# Altium project rt10-r2.PrjPcb (part 2 of 2)

## Sheet mimxrt10xx.SchDoc
size C
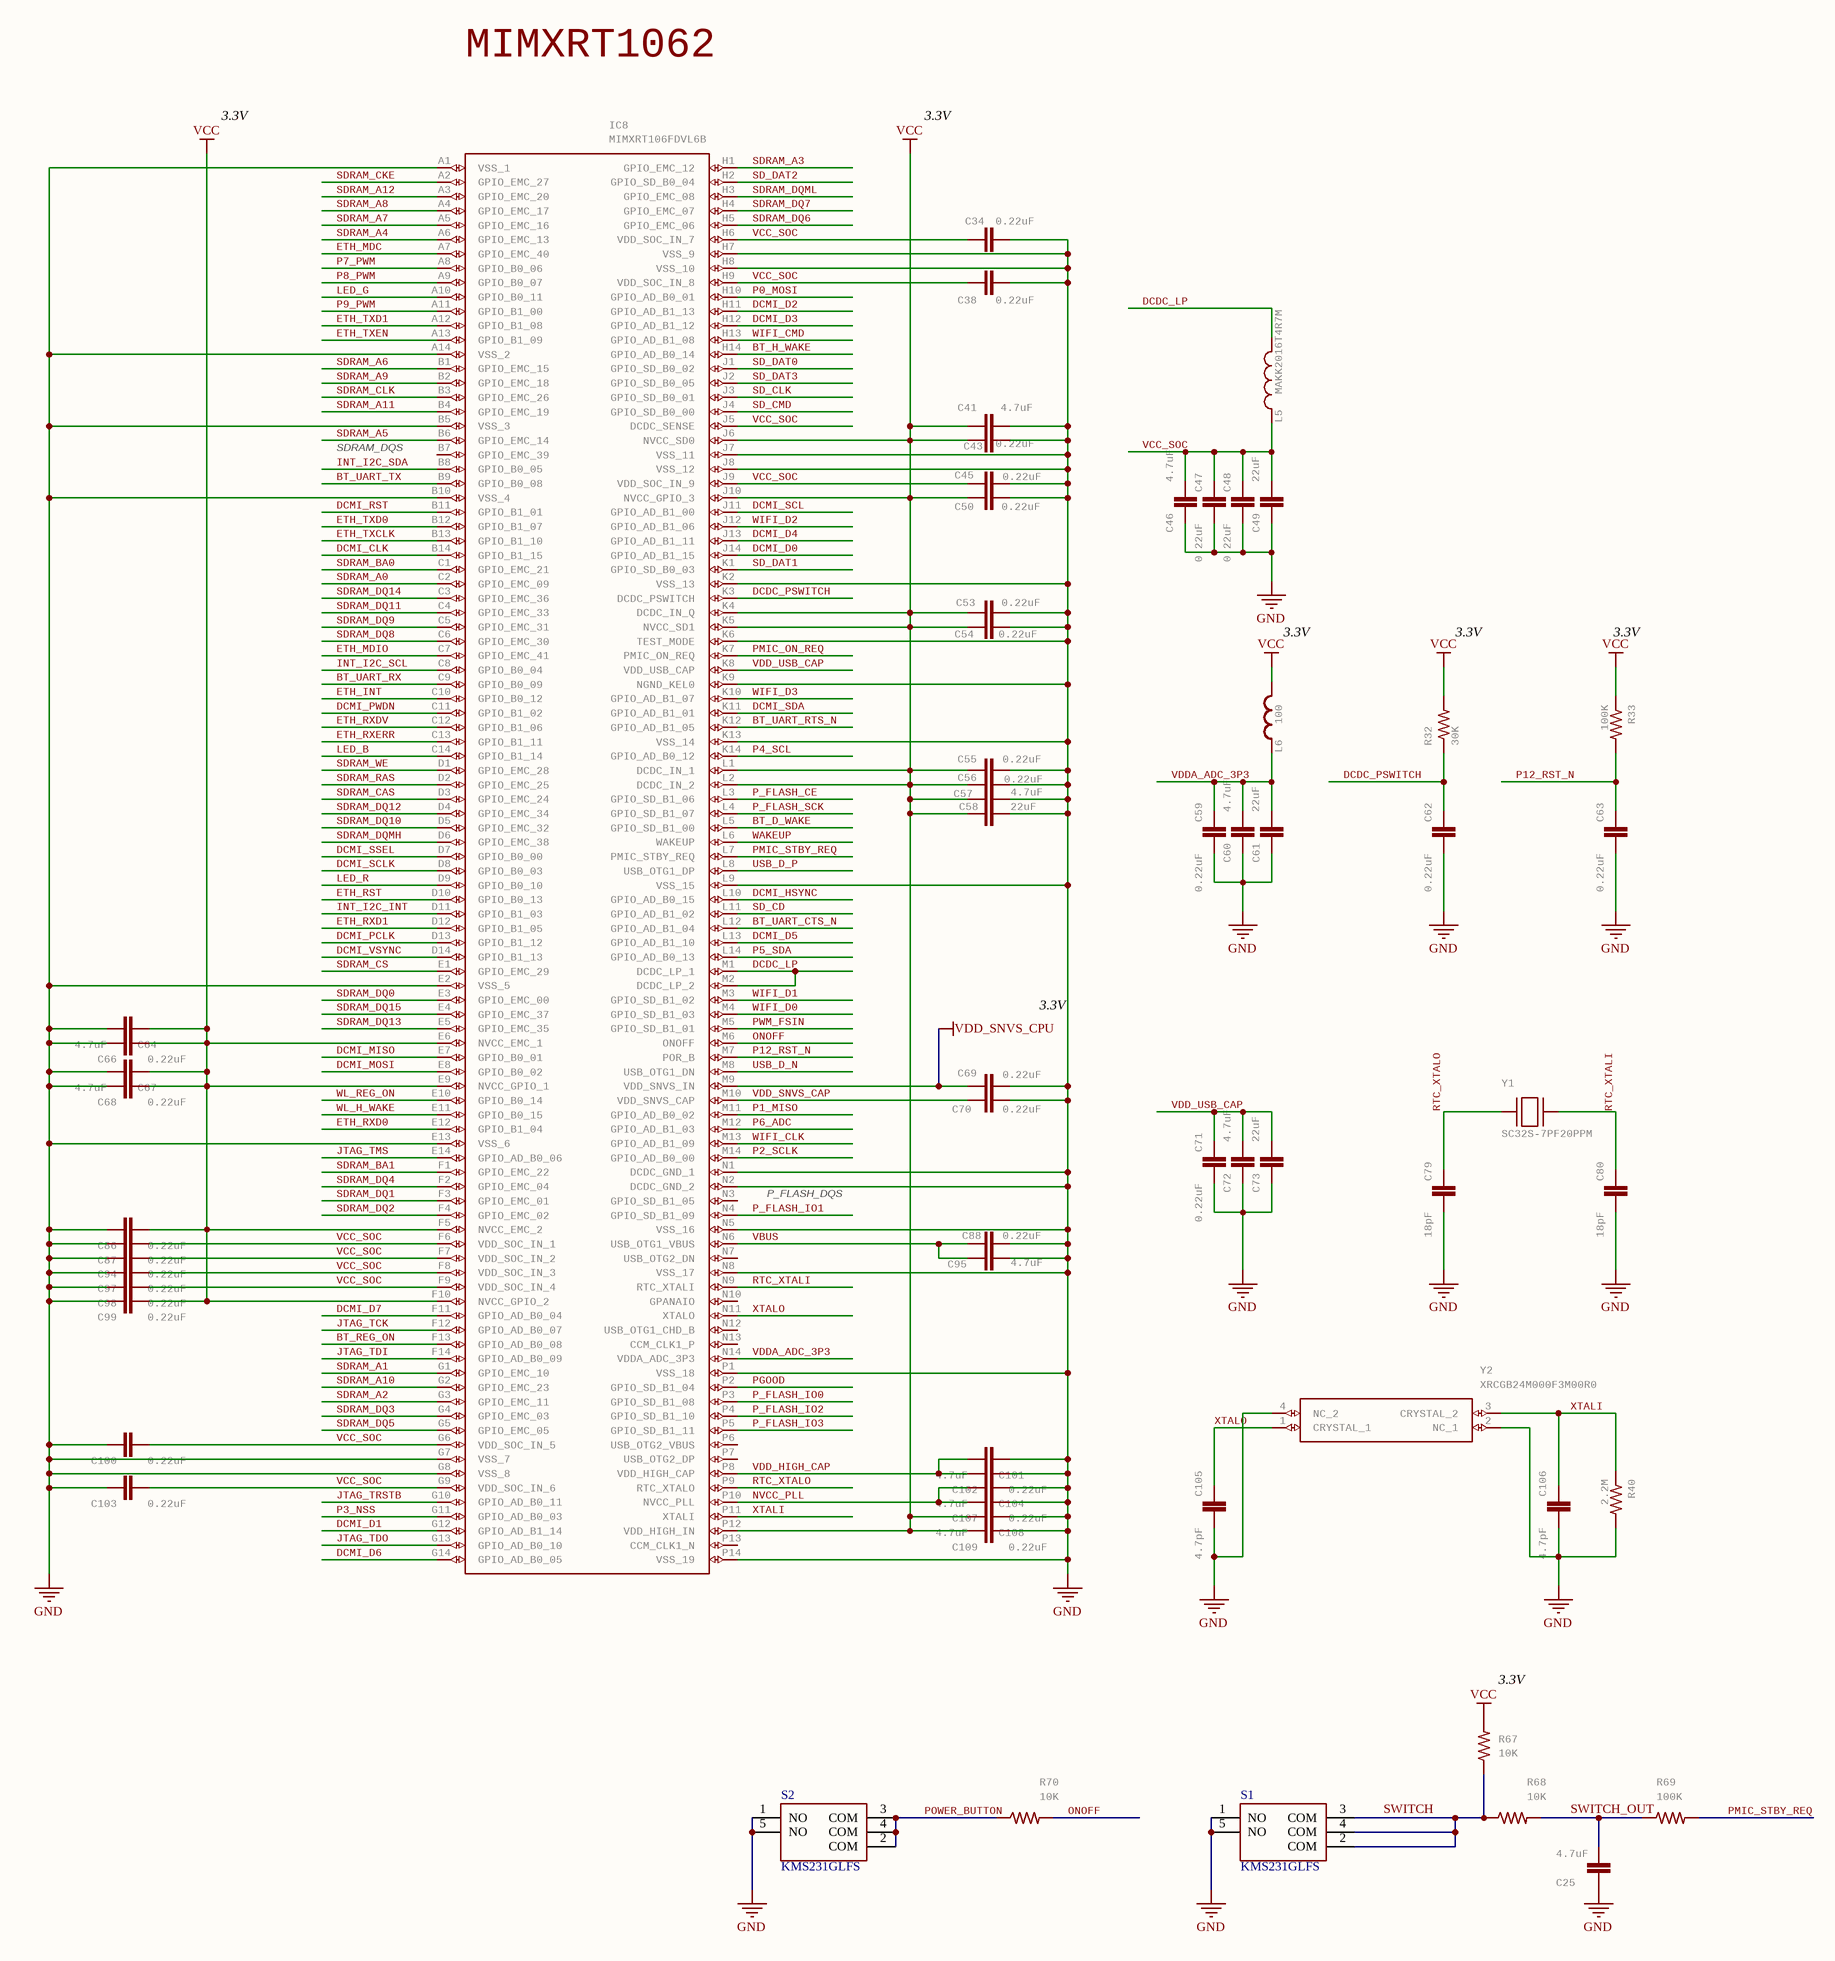
[diagram p13: mimxrt10xx.SchDoc]

### Parts
C25  4.7uF  [0402-CAP]
C34  0.22uF  [C0201]
C38  0.22uF  [C0201]
C41  4.7uF  [0402-CAP]
C43  0.22uF  [C0201]
C45  0.22uF  [C0201]
C46  4.7uF  [0402-CAP]
C47  0.22uF  [C0201]
C48  0.22uF  [C0201]
C49  22uF  [0805]
C50  0.22uF  [C0201]
C53  0.22uF  [C0201]
C54  0.22uF  [C0201]
C55  0.22uF  [C0201]
C56  0.22uF  [C0201]
C57  4.7uF  [0402-CAP]
C58  22uF  [0805]
C59  0.22uF  [C0201]
C60  4.7uF  [0402-CAP]
C61  22uF  [0805]
C62  0.22uF  [C0201]
C63  0.22uF  [C0201]
C64  4.7uF  [0402-CAP]
C66  0.22uF  [C0201]
C67  4.7uF  [0402-CAP]
C68  0.22uF  [C0201]
C69  0.22uF  [C0201]
C70  0.22uF  [C0201]
C71  0.22uF  [C0201]
C72  4.7uF  [0402-CAP]
C73  22uF  [0805]
C79  18pF  [C0201]
C80  18pF  [C0201]
C86  0.22uF  [C0201]
C87  0.22uF  [C0201]
C88  0.22uF  [C0201]
C94  0.22uF  [C0201]
C95  4.7uF  [0402-CAP]
C97  0.22uF  [C0201]
C98  0.22uF  [C0201]
C99  0.22uF  [C0201]
C100  0.22uF  [C0201]
C101  4.7uF  [0402-CAP]
C102  0.22uF  [C0201]
C103  0.22uF  [C0201]
C104  4.7uF  [0402-CAP]
C105  4.7pF  [C0201]
C106  4.7pF  [C0201]
C107  0.22uF  [C0201]
C108  4.7uF  [0402-CAP]
C109  0.22uF  [C0201]
IC8  MIMXRT106FDVL6B  [BGA196C65P14X14_1000X1000X143]
L5  MAKK2016T4R7M  [INDC2016X100N]
L6  100  [C0402]
R32  30K  [0201-RES]
R33  100K  [0402-RES]
R40  2.2M  [0402-RES]
R67  10K  [0402-RES]
R68  10K  [0402-RES]
R69  100K  [0402-RES]
R70  10K  [0402-RES]
S1  KMS231GLFS  [KMS231GLFS]
S2  KMS231GLFS  [KMS231GLFS]
Y1  SC32S-7PF20PPM  [XTAL_ABS07-32.768KHZ-7-T]
Y2  XRCGB24M000F3M00R0  [XRCGB24M000F3M00R0]

### Nets
GND: C25.1 C34.2 C38.2 C41.1 C43.2 C45.2 C46.1 C47.2 C48.2 C49.1 C50.2 C53.2 C54.2 C55.2 C56.2 C57.1 C58.1 C59.2 C60.1 C61.1 C62.2 C63.2 C64.2 C66.1 C67.2 C68.1 C69.2 C70.2 C71.2 C72.1 C73.1 C79.2 C80.2 C86.1 C87.1 C88.2 C94.1 C95.1 C97.1 C98.1 C99.1 C100.1 C101.1 C102.2 C103.1 C104.1 C105.2 C106.2 C107.2 C108.1 C109.2 IC8.A1(VSS_1) IC8.A14(VSS_2) IC8.B5(VSS_3) IC8.B10(VSS_4) IC8.E2(VSS_5) IC8.E13(VSS_6) IC8.G7(VSS_7) IC8.G8(VSS_8) IC8.H7(VSS_9) IC8.H8(VSS_10) IC8.J7(VSS_11) IC8.J8(VSS_12) IC8.K2(VSS_13) IC8.K6(TEST_MODE) IC8.K9(NGND_KEL0) IC8.K13(VSS_14) IC8.L9(VSS_15) IC8.N1(DCDC_GND_1) IC8.N2(DCDC_GND_2) IC8.N5(VSS_16) IC8.N8(VSS_17) IC8.P1(VSS_18) IC8.P14(VSS_19) R40.2 S1.1(NO) S1.5(NO) S2.1(NO) S2.5(NO) Y2.2(NC_1) Y2.4(NC_2)
VBUS: C88.1 C95.2 IC8.N6(USB_OTG1_VBUS)
VCC: C41.2 C43.1 C50.1 C53.1 C54.1 C55.1 C56.1 C57.2 C58.2 C64.1 C66.2 C67.1 C68.2 C86.2 C99.2 C108.2 C109.1 IC8.E6(NVCC_EMC_1) IC8.E9(NVCC_GPIO_1) IC8.F5(NVCC_EMC_2) IC8.F10(NVCC_GPIO_2) IC8.J6(NVCC_SD0) IC8.J10(NVCC_GPIO_3) IC8.K4(DCDC_IN_Q) IC8.K5(NVCC_SD1) IC8.L1(DCDC_IN_1) IC8.L2(DCDC_IN_2) IC8.P12(VDD_HIGH_IN) L6.2 R32.2 R33.1 R67.2
VDD_SNVS_CPU: C69.1 IC8.M9(VDD_SNVS_IN)
BT_D_WAKE: IC8.L5(GPIO_SD_B1_00)
BT_H_WAKE: IC8.H14(GPIO_AD_B0_14)
BT_REG_ON: IC8.F13(GPIO_AD_B0_08)
BT_UART_CTS_N: IC8.L12(GPIO_AD_B1_04)
BT_UART_RTS_N: IC8.K12(GPIO_AD_B1_05)
BT_UART_RX: IC8.C9(GPIO_B0_09)
BT_UART_TX: IC8.B9(GPIO_B0_08)
DCDC_LP: IC8.M1(DCDC_LP_1) IC8.M2(DCDC_LP_2) L5.2
DCDC_PSWITCH: C62.1 IC8.K3(DCDC_PSWITCH) R32.1
DCMI_CLK: IC8.B14(GPIO_B1_15)
DCMI_D0: IC8.J14(GPIO_AD_B1_15)
DCMI_D1: IC8.G12(GPIO_AD_B1_14)
DCMI_D2: IC8.H11(GPIO_AD_B1_13)
DCMI_D3: IC8.H12(GPIO_AD_B1_12)
DCMI_D4: IC8.J13(GPIO_AD_B1_11)
DCMI_D5: IC8.L13(GPIO_AD_B1_10)
DCMI_D6: IC8.G14(GPIO_AD_B0_05)
DCMI_D7: IC8.F11(GPIO_AD_B0_04)
DCMI_HSYNC: IC8.L10(GPIO_AD_B0_15)
DCMI_MISO: IC8.E7(GPIO_B0_01)
DCMI_MOSI: IC8.E8(GPIO_B0_02)
DCMI_PCLK: IC8.D13(GPIO_B1_12)
DCMI_PWDN: IC8.C11(GPIO_B1_02)
DCMI_RST: IC8.B11(GPIO_B1_01)
DCMI_SCL: IC8.J11(GPIO_AD_B1_00)
DCMI_SCLK: IC8.D8(GPIO_B0_03)
DCMI_SDA: IC8.K11(GPIO_AD_B1_01)
DCMI_SSEL: IC8.D7(GPIO_B0_00)
DCMI_VSYNC: IC8.D14(GPIO_B1_13)
ETH_INT: IC8.C10(GPIO_B0_12)
ETH_MDC: IC8.A7(GPIO_EMC_40)
ETH_MDIO: IC8.C7(GPIO_EMC_41)
ETH_RST: IC8.D10(GPIO_B0_13)
ETH_RXD0: IC8.E12(GPIO_B1_04)
ETH_RXD1: IC8.D12(GPIO_B1_05)
ETH_RXDV: IC8.C12(GPIO_B1_06)
ETH_RXERR: IC8.C13(GPIO_B1_11)
ETH_TXCLK: IC8.B13(GPIO_B1_10)
ETH_TXD0: IC8.B12(GPIO_B1_07)
ETH_TXD1: IC8.A12(GPIO_B1_08)
ETH_TXEN: IC8.A13(GPIO_B1_09)
INT_I2C_INT: IC8.D11(GPIO_B1_03)
INT_I2C_SCL: IC8.C8(GPIO_B0_04)
INT_I2C_SDA: IC8.B8(GPIO_B0_05)
JTAG_TCK: IC8.F12(GPIO_AD_B0_07)
JTAG_TDI: IC8.F14(GPIO_AD_B0_09)
JTAG_TDO: IC8.G13(GPIO_AD_B0_10)
JTAG_TMS: IC8.E14(GPIO_AD_B0_06)
JTAG_TRSTB: IC8.G10(GPIO_AD_B0_11)
LED_B: IC8.C14(GPIO_B1_14)
LED_G: IC8.A10(GPIO_B0_11)
LED_R: IC8.D9(GPIO_B0_10)
NVCC_PLL: C104.2 C107.1 IC8.P10(NVCC_PLL)
ONOFF: IC8.M6(ONOFF) R70.2
P0_MOSI: IC8.H10(GPIO_AD_B0_01)
P1_MISO: IC8.M11(GPIO_AD_B0_02)
P2_SCLK: IC8.M14(GPIO_AD_B0_00)
P3_NSS: IC8.G11(GPIO_AD_B0_03)
P4_SCL: IC8.K14(GPIO_AD_B0_12)
P5_SDA: IC8.L14(GPIO_AD_B0_13)
P6_ADC: IC8.M12(GPIO_AD_B1_03)
P7_PWM: IC8.A8(GPIO_B0_06)
P8_PWM: IC8.A9(GPIO_B0_07)
P9_PWM: IC8.A11(GPIO_B1_00)
P12_RST_N: C63.1 IC8.M7(POR_B) R33.2
P_FLASH_CE: IC8.L3(GPIO_SD_B1_06)
P_FLASH_IO0: IC8.P3(GPIO_SD_B1_08)
P_FLASH_IO1: IC8.N4(GPIO_SD_B1_09)
P_FLASH_IO2: IC8.P4(GPIO_SD_B1_10)
P_FLASH_IO3: IC8.P5(GPIO_SD_B1_11)
P_FLASH_SCK: IC8.L4(GPIO_SD_B1_07)
PGOOD: IC8.P2(GPIO_SD_B1_04)
PMIC_ON_REQ: IC8.K7(PMIC_ON_REQ)
PMIC_STBY_REQ: IC8.L7(PMIC_STBY_REQ) R69.2
POWER_BUTTON: R70.1 S2.2(COM) S2.3(COM) S2.4(COM)
PWM_FSIN: IC8.M5(GPIO_SD_B1_01)
RTC_XTALI: C80.1 IC8.N9(RTC_XTALI) Y1.2
RTC_XTALO: C79.1 IC8.P9(RTC_XTALO) Y1.1
SD_CD: IC8.L11(GPIO_AD_B1_02)
SD_CLK: IC8.J3(GPIO_SD_B0_01)
SD_CMD: IC8.J4(GPIO_SD_B0_00)
SD_DAT0: IC8.J1(GPIO_SD_B0_02)
SD_DAT1: IC8.K1(GPIO_SD_B0_03)
SD_DAT2: IC8.H2(GPIO_SD_B0_04)
SD_DAT3: IC8.J2(GPIO_SD_B0_05)
SDRAM_A0: IC8.C2(GPIO_EMC_09)
SDRAM_A1: IC8.G1(GPIO_EMC_10)
SDRAM_A2: IC8.G3(GPIO_EMC_11)
SDRAM_A3: IC8.H1(GPIO_EMC_12)
SDRAM_A4: IC8.A6(GPIO_EMC_13)
SDRAM_A5: IC8.B6(GPIO_EMC_14)
SDRAM_A6: IC8.B1(GPIO_EMC_15)
SDRAM_A7: IC8.A5(GPIO_EMC_16)
SDRAM_A8: IC8.A4(GPIO_EMC_17)
SDRAM_A9: IC8.B2(GPIO_EMC_18)
SDRAM_A10: IC8.G2(GPIO_EMC_23)
SDRAM_A11: IC8.B4(GPIO_EMC_19)
SDRAM_A12: IC8.A3(GPIO_EMC_20)
SDRAM_BA0: IC8.C1(GPIO_EMC_21)
SDRAM_BA1: IC8.F1(GPIO_EMC_22)
SDRAM_CAS: IC8.D3(GPIO_EMC_24)
SDRAM_CKE: IC8.A2(GPIO_EMC_27)
SDRAM_CLK: IC8.B3(GPIO_EMC_26)
SDRAM_CS: IC8.E1(GPIO_EMC_29)
SDRAM_DQ0: IC8.E3(GPIO_EMC_00)
SDRAM_DQ1: IC8.F3(GPIO_EMC_01)
SDRAM_DQ2: IC8.F4(GPIO_EMC_02)
SDRAM_DQ3: IC8.G4(GPIO_EMC_03)
SDRAM_DQ4: IC8.F2(GPIO_EMC_04)
SDRAM_DQ5: IC8.G5(GPIO_EMC_05)
SDRAM_DQ6: IC8.H5(GPIO_EMC_06)
SDRAM_DQ7: IC8.H4(GPIO_EMC_07)
SDRAM_DQ8: IC8.C6(GPIO_EMC_30)
SDRAM_DQ9: IC8.C5(GPIO_EMC_31)
SDRAM_DQ10: IC8.D5(GPIO_EMC_32)
SDRAM_DQ11: IC8.C4(GPIO_EMC_33)
SDRAM_DQ12: IC8.D4(GPIO_EMC_34)
SDRAM_DQ13: IC8.E5(GPIO_EMC_35)
SDRAM_DQ14: IC8.C3(GPIO_EMC_36)
SDRAM_DQ15: IC8.E4(GPIO_EMC_37)
SDRAM_DQMH: IC8.D6(GPIO_EMC_38)
SDRAM_DQML: IC8.H3(GPIO_EMC_08)
SDRAM_RAS: IC8.D2(GPIO_EMC_25)
SDRAM_WE: IC8.D1(GPIO_EMC_28)
SWITCH: R67.1 R68.1 S1.2(COM) S1.3(COM) S1.4(COM)
SWITCH_OUT: C25.2 R68.2 R69.1
USB_D_N: IC8.M8(USB_OTG1_DN)
USB_D_P: IC8.L8(USB_OTG1_DP)
VCC_SOC: C34.1 C38.1 C45.1 C46.2 C47.1 C48.1 C49.2 C87.2 C94.2 C97.2 C98.2 C100.2 C103.2 IC8.F6(VDD_SOC_IN_1) IC8.F7(VDD_SOC_IN_2) IC8.F8(VDD_SOC_IN_3) IC8.F9(VDD_SOC_IN_4) IC8.G6(VDD_SOC_IN_5) IC8.G9(VDD_SOC_IN_6) IC8.H6(VDD_SOC_IN_7) IC8.H9(VDD_SOC_IN_8) IC8.J5(DCDC_SENSE) IC8.J9(VDD_SOC_IN_9) L5.1
VDD_HIGH_CAP: C101.2 C102.1 IC8.P8(VDD_HIGH_CAP)
VDD_SNVS_CAP: C70.1 IC8.M10(VDD_SNVS_CAP)
VDD_USB_CAP: C71.1 C72.2 C73.2 IC8.K8(VDD_USB_CAP)
VDDA_ADC_3P3: C59.1 C60.2 C61.2 IC8.N14(VDDA_ADC_3P3) L6.1
WAKEUP: IC8.L6(WAKEUP)
WIFI_CLK: IC8.M13(GPIO_AD_B1_09)
WIFI_CMD: IC8.H13(GPIO_AD_B1_08)
WIFI_D0: IC8.M4(GPIO_SD_B1_03)
WIFI_D1: IC8.M3(GPIO_SD_B1_02)
WIFI_D2: IC8.J12(GPIO_AD_B1_06)
WIFI_D3: IC8.K10(GPIO_AD_B1_07)
WL_H_WAKE: IC8.E11(GPIO_B0_15)
WL_REG_ON: IC8.E10(GPIO_B0_14)
XTALI: C106.1 IC8.P11(XTALI) R40.1 Y2.3(CRYSTAL_2)
XTALO: C105.1 IC8.N11(XTALO) Y2.1(CRYSTAL_1)

Not connected (* = marked no-connect by the designer): IC8 B7(GPIO_EMC_39) N3(GPIO_SD_B1_05) N7(USB_OTG2_DN) N10(GPANAIO) N12(USB_OTG1_CHD_B) N13(CCM_CLK1_P) P6(USB_OTG2_VBUS) P7(USB_OTG2_DP) P13(CCM_CLK1_N)

### Notes on the sheet
- MIMXRT1062
- 3.3V
- SDRAM_DQS
- (near L6) 3.3V
- P_FLASH_DQS
- (near R67) 3.3V

### Library data of the parts
C25 C41 C46 C57 C60 C64 C67 C72 C95 C101 C104 C108 = CAP0402-CAP: CapacitorStandard 0603 ceramic capacitor, and 0.1" leaded capacitor.; MPN: JMK105BBJ475MV-F; GateName_1: G$1; SymbolName_1: CAP; DeviceName: 0402-CAP; LibraryName: sfe; DeviceSetName: CAP; Part Number: JMK105BBJ475MV-F
C34 C38 C43 C45 C47 C48 C50 C53-C56 C59 C62 C63 C66 C68-C71 C86-C88 C94 C97-C100 C102 C103 C107 C109 = C-EUC0201: CAPACITOR, European symbol; MPN: GRM033R60J224ME15D; GateName_1: G$1; SymbolName_1: C-EU; POPULARITY: 0; DeviceName: C0201; LibraryName: rcl; DeviceSetName: C-EU; SPICEPREFIX: C; Part Number: GRM033R60J224ME15D
C49 C58 C61 C73 = 22UF-0805-6.3V-20%: 22ÂµF ceramic capacitors    A capacitor is a passive two-terminal electrical component used to store electrical energy temporarily in an electric field.; MPN: CL21A226MQQNNNE; GateName_1: G$1; SymbolName_1: CAP; PROD_ID: CAP-08402; DeviceName: -0805-6.3V-20%; LibraryName: SparkFun-Capacitors; DeviceSetName: 22UF; Part Number: CL21A226MQQNNNE
C79 C80 = C-EUC0201: CAPACITOR, European symbol; MPN: GRM0335C1E180JA01D; GateName_1: G$1; SymbolName_1: C-EU; POPULARITY: 0; DeviceName: C0201; LibraryName: rcl; DeviceSetName: C-EU; SPICEPREFIX: C; Part Number: GRM0335C1E180JA01D
C105 C106 = C-EUC0201: CAPACITOR, European symbol; MPN: GRM0335C1E4R7CA01D; GateName_1: G$1; SymbolName_1: C-EU; POPULARITY: 0; DeviceName: C0201; LibraryName: rcl; DeviceSetName: C-EU; SPICEPREFIX: C; Part Number: GRM0335C1E4R7CA01D
IC8 = MIMXRT1052DVL6B: Processors - Application Specialized MIMXRT106FDVL6B/LFBGA196///STANDARD MARKING * TRAY   Source:  Datasheet; MANUFACTURER_NAME: NXP; GateName_1: G$1; HEIGHT: 1.43mm; MANUFACTURER_PART_NUMBER: MIMXRT106FDVL6B; MPN: MIMXRT106FDVL6B; Part Number: MIMXRT106FDVL6B
L5 = MAKK2016T4R7M: INDUCTOR, METAL CORE, SHIELDED, SMD HIGH CURRENT, 4.7uH, 20%, TR Check availability; GateName_1: G$1; MF: Taiyo Yuden; SymbolName_1: MAKK2016T4R7M; LibraryName: MAKK2016T4R7M; DeviceSetName: MAKK2016T4R7M; AVAILABILITY: In Stock; MP: MAKK2016T4R7M; MPN: MAKK2016T4R7M; PACKAGE: 2016 Taiyo Yuden; PRICE: None; PURCHASE-URL: https://pricing.snapeda.com/search/part/MAKK2016T4R7M/?ref=eda; Part Number: MAKK2016T4R7M
L6 = INDUCTOR0402: InductorsBasic Inductor/Choke - 0603 and 1206. Footprints are not proven and vary greatly between part numbers.; MPN: MFBM1V1005-101-R; GateName_1: G$1; DeviceName: 0402; SymbolName_1: INDUCTOR; LibraryName: sfe; DeviceSetName: INDUCTOR; Part Number: MFBM1V1005-101-R
R32 = RESISTOR0402-RES: ResistorBasic schematic elements and footprints for 0603, 1206, and PTH resistors.; MPN: RC0201FR-0730KL; GateName_1: G$1; SymbolName_1: RESISTOR; DeviceName: 0402-RES; LibraryName: sfe; DeviceSetName: RESISTOR; Part Number: RC0201FR-0730KL
R33 R69 = RESISTOR0402-RES: ResistorBasic schematic elements and footprints for 0603, 1206, and PTH resistors.; MPN: AC0402FR-07100KL; GateName_1: G$1; SymbolName_1: RESISTOR; DeviceName: 0402-RES; LibraryName: sfe; DeviceSetName: RESISTOR; Part Number: AC0402FR-07100KL
R40 = RESISTOR0402-RES: ResistorBasic schematic elements and footprints for 0603, 1206, and PTH resistors.; MPN: RC0402FR-072M2L; GateName_1: G$1; SymbolName_1: RESISTOR; DeviceName: 0402-RES; LibraryName: sfe; DeviceSetName: RESISTOR; Part Number: RC0402FR-072M2L
R67 R68 R70 = RESISTOR0402-RES: ResistorBasic schematic elements and footprints for 0603, 1206, and PTH resistors.; MPN: AC0402FR-1310K; GateName_1: G$1; SymbolName_1: RESISTOR; DeviceName: 0402-RES; LibraryName: sfe; DeviceSetName: RESISTOR; Part Number: AC0402FR-1310K
Y1 = ABS07-32.768KHZ-7-T: Check availability; GateName_1: G$1; MF: Abracon; SymbolName_1: ABS07-32.768KHZ-7-T; LibraryName: ABS07-32.768KHZ-7-T; DeviceSetName: ABS07-32.768KHZ-7-T; AVAILABILITY: In Stock; MP: ABS07-32.768KHZ-7-T; MPN: SC32S-7PF20PPM; PACKAGE: SMD-2 Abracon LLC; PRICE: None; PURCHASE-URL: https://pricing.snapeda.com/search/part/ABS07-32.768KHZ-7-T/?ref=eda; Part Number: SC32S-7PF20PPM
Y2 = XRCGB24M000F3M00R0: Murata 24MHz Crystal +/-30ppm SMD 4-Pin 2 x 1.6 x 0.7mm   Source:  Datasheet; MANUFACTURER_NAME: Murata Electronics; GateName_1: G$1; SymbolName_1: XRCGB24M000F3M00R0; LibraryName: XRCGB24M000F3M00R0; DeviceSetName: XRCGB24M000F3M00R0; HEIGHT: mm; MANUFACTURER_PART_NUMBER: XRCGB24M000F3M00R0; MOUSER_PART_NUMBER: 81-XRCGB24M000F3M0R0; MOUSER_PRICE-STOCK: https://www.mouser.co.uk/ProductDetail/Murata-Electronics/XRCGB24M000F3M00R0?qs=e%252BE4OD6MgMefDn8VvwDdfw%3D%3D; MPN: XRCGB24M000F3M00R0; Part Number: XRCGB24M000F3M00R0
S1 S2 = KMS231GLFS: Part Number: KMS231GLFS; MPN: KMS231GLFS

## Nets that join several sheets
GND: usb (8 pins), ideal-diode (6 pins), battery-charging (14 pins), regulators (8 pins), sdram-16-bit (20 pins), qspi-flash (C22.2 C23.1 IC5.4 IC5.9), security-accelerometer (9 pins), sd-card (9 pins), sensor-header (13 pins), io-headers (11 pins), jtag (5 pins), ethernet (12 pins), wifi-bt (15 pins), mimxrt10xx (81 pins)
RAW: battery-charging (C10.2 U2.5 U2.10 U2.11), regulators (8 pins), io-headers (D5.1 J3.2)
V_BATT: ideal-diode (C4.2 IC1.2 IC1.7), battery-charging (C9.2 U2.13)
VBUS: usb (FL1.1 L1.2), ideal-diode (C3.2 IC1.3), mimxrt10xx (C88.1 C95.2 IC8.N6)
VCC: ideal-diode (D1.4 R14.2), battery-charging (R42.2 R43.2), regulators (C7.1 IC2.6 L2.2 R2.2), sdram-16-bit (21 pins), qspi-flash (8 pins), security-accelerometer (10 pins), sd-card (11 pins), sensor-header (17 pins), io-headers (D4.1 D14.1 J2.1 J9.1), jtag (D10.1 J8.1), ethernet (8 pins), wifi-bt (17 pins), mimxrt10xx (32 pins)
VDD_SNVS_CPU: regulators (D11.3 Q1.1 Q2.1 Q3.1), mimxrt10xx (C69.1 IC8.M9)
BT_D_WAKE: wifi-bt (U3.39), mimxrt10xx (IC8.L5)
BT_H_WAKE: wifi-bt (R60.2 U3.38), mimxrt10xx (IC8.H14)
BT_REG_ON: jtag (R37.1), wifi-bt (U3.14), mimxrt10xx (IC8.F13)
BT_UART_CTS_N: wifi-bt (U3.5), mimxrt10xx (IC8.L12)
BT_UART_RTS_N: wifi-bt (U3.4), mimxrt10xx (IC8.K12)
BT_UART_RX: wifi-bt (U3.3), mimxrt10xx (IC8.C9)
BT_UART_TX: wifi-bt (U3.2), mimxrt10xx (IC8.B9)
CHG: battery-charging (R1.1 R42.1 U2.9), jtag (R72.2)
DCMI_CLK: sensor-header (J4.12), mimxrt10xx (IC8.B14)
DCMI_D0: sensor-header (J4.31), mimxrt10xx (IC8.J14)
DCMI_D1: sensor-header (J4.29), mimxrt10xx (IC8.G12)
DCMI_D2: sensor-header (J4.35), mimxrt10xx (IC8.H11)
DCMI_D3: sensor-header (J4.28), mimxrt10xx (IC8.H12)
DCMI_D4: sensor-header (J4.26), mimxrt10xx (IC8.J13)
DCMI_D5: sensor-header (J4.33), mimxrt10xx (IC8.L13)
DCMI_D6: sensor-header (J4.24), mimxrt10xx (IC8.G14)
DCMI_D7: sensor-header (J4.22), io-headers (R57.1), mimxrt10xx (IC8.F11)
DCMI_HSYNC: sensor-header (J4.18), mimxrt10xx (IC8.L10)
DCMI_MISO: sensor-header (J4.15), mimxrt10xx (IC8.E7)
DCMI_MOSI: sensor-header (J4.17), mimxrt10xx (IC8.E8)
DCMI_PCLK: sensor-header (J4.14), mimxrt10xx (IC8.D13)
DCMI_PWDN: sensor-header (J4.25 R29.1), mimxrt10xx (IC8.C11)
DCMI_RST: sensor-header (J4.21 R27.1), mimxrt10xx (IC8.B11)
DCMI_SCL: sensor-header (J4.32 R30.1), mimxrt10xx (IC8.J11)
DCMI_SCLK: sensor-header (J4.13), mimxrt10xx (IC8.D8)
DCMI_SDA: sensor-header (J4.34 R31.1), mimxrt10xx (IC8.K11)
DCMI_SSEL: sensor-header (J4.11 R24.1), mimxrt10xx (IC8.D7)
DCMI_VSYNC: sensor-header (J4.16), mimxrt10xx (IC8.D14)
ETH_INT: ethernet (IC9.18 R36.1), mimxrt10xx (IC8.C10)
ETH_MDC: ethernet (IC9.11), mimxrt10xx (IC8.A7)
ETH_MDIO: ethernet (IC9.10 R39.1), mimxrt10xx (IC8.C7)
ETH_RST: ethernet (C65.2 IC9.24 R34.1), mimxrt10xx (IC8.D10)
ETH_RXD0: ethernet (IC9.13), mimxrt10xx (IC8.E12)
ETH_RXD1: ethernet (IC9.12), mimxrt10xx (IC8.D12)
ETH_RXDV: ethernet (IC9.15), mimxrt10xx (IC8.C12)
ETH_RXERR: ethernet (IC9.17), mimxrt10xx (IC8.C13)
ETH_TXCLK: ethernet (IC9.8), mimxrt10xx (IC8.B13)
ETH_TXD0: ethernet (IC9.20), mimxrt10xx (IC8.B12)
ETH_TXD1: ethernet (IC9.21), mimxrt10xx (IC8.A12)
ETH_TXEN: ethernet (IC9.19), mimxrt10xx (IC8.A13)
INT_I2C_INT: security-accelerometer (IC7.4 R17.1), mimxrt10xx (IC8.D11)
INT_I2C_SCL: security-accelerometer (IC4.10 IC7.1 R15.1), mimxrt10xx (IC8.C8)
INT_I2C_SDA: security-accelerometer (IC4.9 IC7.5 R16.1), mimxrt10xx (IC8.B8)
JTAG_TCK: jtag (FL5.4), mimxrt10xx (IC8.F12)
JTAG_TDI: jtag (FL5.2 R71.1), mimxrt10xx (IC8.F14)
JTAG_TDI_INT: io-headers (R55.1), jtag (FL5.11 R58.1)
JTAG_TDO: jtag (FL5.3), mimxrt10xx (IC8.G13)
JTAG_TMS: jtag (FL5.5), mimxrt10xx (IC8.E14)
JTAG_TRSTB: jtag (FL5.6), mimxrt10xx (IC8.G10)
JTAG_TRSTB_INT: io-headers (R56.1), jtag (FL5.7 R59.2)
LED_B: qspi-flash (R19.1 R44.2), mimxrt10xx (IC8.C14)
LED_CHG: ideal-diode (D1.3), battery-charging (R1.2)
LED_G: qspi-flash (R20.1 R45.2), mimxrt10xx (IC8.A10)
LED_PGOOD: ideal-diode (D1.2), battery-charging (R4.2)
LED_R: qspi-flash (R21.1 R46.2), mimxrt10xx (IC8.D9)
MDI_LED: io-headers (J3.8), ethernet (R35.2)
MDI_RX_N: io-headers (J3.7), ethernet (IC9.3)
MDI_RX_P: io-headers (J3.6), ethernet (IC9.4)
MDI_TX_N: io-headers (J3.5), ethernet (IC9.5)
MDI_TX_P: io-headers (J3.4), ethernet (IC9.6)
ONOFF: regulators (Q3.2), mimxrt10xx (IC8.M6 R70.2)
P0_MOSI: io-headers (FL2.1), mimxrt10xx (IC8.H10)
P1_MISO: io-headers (FL2.2), mimxrt10xx (IC8.M11)
P2_SCLK: io-headers (FL2.3), mimxrt10xx (IC8.M14)
P3_NSS: io-headers (FL2.4), mimxrt10xx (IC8.G11)
P4_SCL: io-headers (FL2.5), mimxrt10xx (IC8.K14)
P5_SDA: io-headers (FL2.6), mimxrt10xx (IC8.L14)
P6_ADC: io-headers (FL4.1), mimxrt10xx (IC8.M12)
P7_PWM: io-headers (FL4.2), mimxrt10xx (IC8.A8)
P8_PWM: io-headers (FL4.3), mimxrt10xx (IC8.A9)
P9_PWM: io-headers (FL4.4), mimxrt10xx (IC8.A11)
P10_PWM: sensor-header (R54.1), io-headers (FL4.5)
P11_WAKEUP: regulators (Q2.3 R22.1), io-headers (FL4.6)
P12_RST_N: jtag (FL5.1 R72.1), mimxrt10xx (C63.1 IC8.M7 R33.2)
P12_RST_N_EXT: io-headers (J6.8), jtag (FL5.12 J8.10)
P_FLASH_CE: qspi-flash (IC5.1 R13.2), mimxrt10xx (IC8.L3)
P_FLASH_IO0: qspi-flash (IC5.5), mimxrt10xx (IC8.P3)
P_FLASH_IO1: qspi-flash (IC5.2), mimxrt10xx (IC8.N4)
P_FLASH_IO2: qspi-flash (IC5.3), mimxrt10xx (IC8.P4)
P_FLASH_IO3: qspi-flash (IC5.7), mimxrt10xx (IC8.P5)
P_FLASH_SCK: qspi-flash (IC5.6), mimxrt10xx (IC8.L4)
PGOOD: battery-charging (R4.1 R43.1 U2.7), mimxrt10xx (IC8.P2)
PMIC_ON_REQ: regulators (Q1.2), mimxrt10xx (IC8.K7)
PMIC_ONOFF: regulators (Q3.3 R23.1), io-headers (D8.1 J3.3)
PWM_FSIN: sensor-header (R28.2 R53.2 R54.2), mimxrt10xx (IC8.M5)
SD_CD: sd-card (D9.1 J5.CD$1 R52.1), mimxrt10xx (IC8.L11)
SD_CLK: sd-card (FL3.4), mimxrt10xx (IC8.J3)
SD_CMD: sd-card (FL3.3 R49.1), mimxrt10xx (IC8.J4)
SD_DAT0: sd-card (FL3.5 R47.1), mimxrt10xx (IC8.J1)
SD_DAT1: sd-card (FL3.6 R48.1), mimxrt10xx (IC8.K1)
SD_DAT2: sd-card (FL3.1 R51.1), mimxrt10xx (IC8.H2)
SD_DAT3: sd-card (FL3.2 R50.1), mimxrt10xx (IC8.J2)
SDRAM_A0: sdram-16-bit (IC3.H7), mimxrt10xx (IC8.C2)
SDRAM_A1: sdram-16-bit (IC3.H8), mimxrt10xx (IC8.G1)
SDRAM_A2: sdram-16-bit (IC3.J8), mimxrt10xx (IC8.G3)
SDRAM_A3: sdram-16-bit (IC3.J7), mimxrt10xx (IC8.H1)
SDRAM_A4: sdram-16-bit (IC3.J3), mimxrt10xx (IC8.A6)
SDRAM_A5: sdram-16-bit (IC3.J2), mimxrt10xx (IC8.B6)
SDRAM_A6: sdram-16-bit (IC3.H3), mimxrt10xx (IC8.B1)
SDRAM_A7: sdram-16-bit (IC3.H2), mimxrt10xx (IC8.A5)
SDRAM_A8: sdram-16-bit (IC3.H1), mimxrt10xx (IC8.A4)
SDRAM_A9: sdram-16-bit (IC3.G3), mimxrt10xx (IC8.B2)
SDRAM_A10: sdram-16-bit (IC3.H9), mimxrt10xx (IC8.G2)
SDRAM_A11: sdram-16-bit (IC3.G2), mimxrt10xx (IC8.B4)
SDRAM_A12: sdram-16-bit (IC3.G1), mimxrt10xx (IC8.A3)
SDRAM_BA0: sdram-16-bit (IC3.G7), mimxrt10xx (IC8.C1)
SDRAM_BA1: sdram-16-bit (IC3.G8), mimxrt10xx (IC8.F1)
SDRAM_CAS: sdram-16-bit (IC3.F7), mimxrt10xx (IC8.D3)
SDRAM_CKE: sdram-16-bit (IC3.F3), mimxrt10xx (IC8.A2)
SDRAM_CLK: sdram-16-bit (IC3.F2), mimxrt10xx (IC8.B3)
SDRAM_CS: sdram-16-bit (IC3.G9 R18.2), mimxrt10xx (IC8.E1)
SDRAM_DQ0: sdram-16-bit (IC3.A8), mimxrt10xx (IC8.E3)
SDRAM_DQ1: sdram-16-bit (IC3.B9), mimxrt10xx (IC8.F3)
SDRAM_DQ2: sdram-16-bit (IC3.B8), mimxrt10xx (IC8.F4)
SDRAM_DQ3: sdram-16-bit (IC3.C9), mimxrt10xx (IC8.G4)
SDRAM_DQ4: sdram-16-bit (IC3.C8), mimxrt10xx (IC8.F2)
SDRAM_DQ5: sdram-16-bit (IC3.D9), mimxrt10xx (IC8.G5)
SDRAM_DQ6: sdram-16-bit (IC3.D8), mimxrt10xx (IC8.H5)
SDRAM_DQ7: sdram-16-bit (IC3.E9), mimxrt10xx (IC8.H4)
SDRAM_DQ8: sdram-16-bit (IC3.E1), mimxrt10xx (IC8.C6)
SDRAM_DQ9: sdram-16-bit (IC3.D2), mimxrt10xx (IC8.C5)
SDRAM_DQ10: sdram-16-bit (IC3.D1), mimxrt10xx (IC8.D5)
SDRAM_DQ11: sdram-16-bit (IC3.C2), mimxrt10xx (IC8.C4)
SDRAM_DQ12: sdram-16-bit (IC3.C1), mimxrt10xx (IC8.D4)
SDRAM_DQ13: sdram-16-bit (IC3.B2), mimxrt10xx (IC8.E5)
SDRAM_DQ14: sdram-16-bit (IC3.B1), mimxrt10xx (IC8.C3)
SDRAM_DQ15: sdram-16-bit (IC3.A2), mimxrt10xx (IC8.E4)
SDRAM_DQMH: sdram-16-bit (IC3.F1), mimxrt10xx (IC8.D6)
SDRAM_DQML: sdram-16-bit (IC3.E8), mimxrt10xx (IC8.H3)
SDRAM_RAS: sdram-16-bit (IC3.F8), mimxrt10xx (IC8.D2)
SDRAM_WE: sdram-16-bit (IC3.F9), mimxrt10xx (IC8.D1)
ST: ideal-diode (IC1.8 R5.1 R14.1), jtag (R71.2)
USB_D_N: usb (FL1.6), mimxrt10xx (IC8.M8)
USB_D_P: usb (FL1.7), mimxrt10xx (IC8.L8)
WAKEUP: regulators (Q2.2), mimxrt10xx (IC8.L6)
WIFI_CLK: wifi-bt (U3.20), mimxrt10xx (IC8.M13)
WIFI_CMD: wifi-bt (R62.1 U3.22), mimxrt10xx (IC8.H13)
WIFI_D0: wifi-bt (R63.1 U3.24), mimxrt10xx (IC8.M4)
WIFI_D1: wifi-bt (R64.1 U3.26), mimxrt10xx (IC8.M3)
WIFI_D2: wifi-bt (R65.1 U3.23), mimxrt10xx (IC8.J12)
WIFI_D3: wifi-bt (R66.1 U3.25), mimxrt10xx (IC8.K10)
WL_H_WAKE: wifi-bt (R61.1 U3.27), mimxrt10xx (IC8.E11)
WL_REG_ON: wifi-bt (U3.28), mimxrt10xx (IC8.E10)